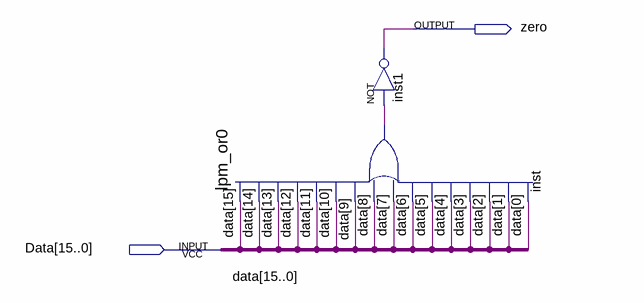
[diagram p0: schematic sheet]
// Quartus schematic ALU_FLAG_ZERO.bdf as structural Verilog: 2 symbols, 2 pins
module ALU_FLAG_ZERO (
  input  [15:0] Data,
  output zero
);

  wire inst_result;

  lpm_or0 inst (
    .data0(Data[15]), .data1(Data[14]), .data2(Data[13]), .data3(Data[12]), .data4(Data[11]),
    .data5(Data[10]), .data6(Data[9]), .data7(Data[8]), .data8(Data[7]), .data9(Data[6]), .data10(Data[5]),
    .data11(Data[4]), .data12(Data[3]), .data13(Data[2]), .data14(Data[1]), .data15(Data[0]),
    .result(inst_result));
  not inst1 (zero, inst_result);
endmodule
